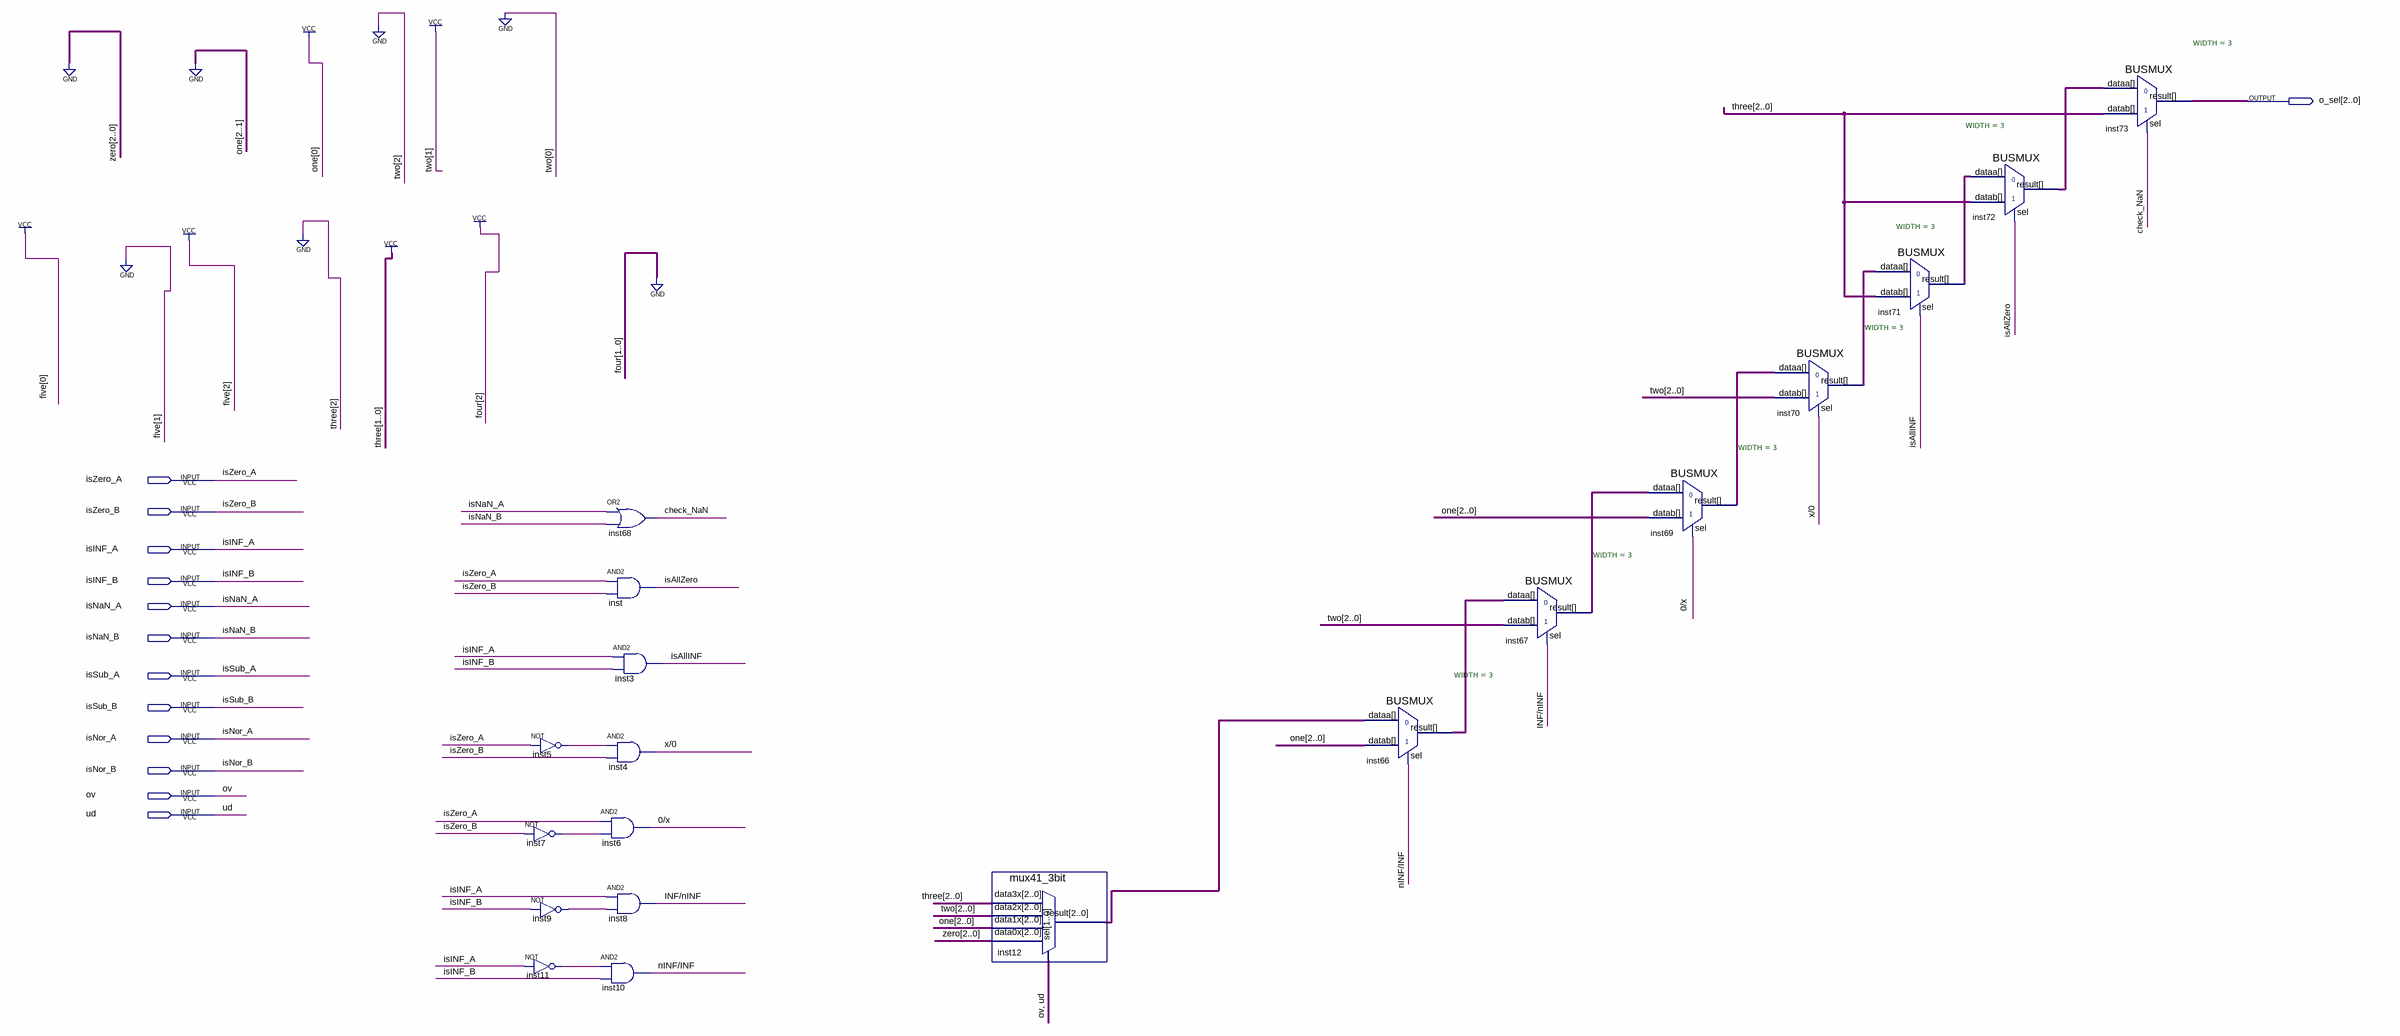
[diagram p0: schematic sheet]
// Quartus schematic divider_control_unit.bdf as structural Verilog: 19 symbols, 13 pins
module divider_control_unit (
  input  isZero_A,
  input  isZero_B,
  input  isINF_A,
  input  isINF_B,
  input  isNaN_A,
  input  isNaN_B,
  input  isSub_A,
  input  isSub_B,
  input  isNor_A,
  input  isNor_B,
  input  ov,
  input  ud,
  output [2:0] o_sel
);

  wire \0/x , check_NaN, \INF/nINF , inst5_out, inst7_out, inst9_out, inst11_out, isAllINF, isAllZero,
       \nINF/INF , \x/0 ;
  wire [2:0] inst12_result, inst66_result, inst67_result, inst69_result, inst70_result, inst71_result,
       inst72_result;

  not inst5 (inst5_out, isZero_A);
  not inst7 (inst7_out, isZero_B);
  not inst9 (inst9_out, isINF_B);
  not inst11 (inst11_out, isINF_A);
  or inst68 (check_NaN, isNaN_A, isNaN_B);
  and inst (isAllZero, isZero_A, isZero_B);
  and inst4 (\x/0 , inst5_out, isZero_B);
  and inst6 (\0/x , isZero_A, inst7_out);
  and inst8 (\INF/nINF , isINF_A, inst9_out);
  and inst10 (\nINF/INF , inst11_out, isINF_B);
  and inst3 (isAllINF, isINF_A, isINF_B);
  mux41_3bit inst12 (
    .data3x(3'b011), .data2x(3'b010), .data1x(3'b001), .data0x(3'b000), .sel({ov, ud}), .result(inst12_result));
  BUSMUX #(.WIDTH(3)) inst66 (.datab(3'b001), .sel(\nINF/INF ), .dataa(inst12_result), .result(inst66_result));
  BUSMUX #(.WIDTH(3)) inst67 (.datab(3'b010), .sel(\INF/nINF ), .dataa(inst66_result), .result(inst67_result));
  BUSMUX #(.WIDTH(3)) inst69 (.datab(3'b001), .sel(\0/x ), .dataa(inst67_result), .result(inst69_result));
  BUSMUX #(.WIDTH(3)) inst70 (.datab(3'b010), .sel(\x/0 ), .dataa(inst69_result), .result(inst70_result));
  BUSMUX #(.WIDTH(3)) inst71 (.datab(3'b011), .sel(isAllINF), .dataa(inst70_result), .result(inst71_result));
  BUSMUX #(.WIDTH(3)) inst72 (.datab(3'b011), .sel(isAllZero), .dataa(inst71_result), .result(inst72_result));
  BUSMUX #(.WIDTH(3)) inst73 (.datab(3'b011), .sel(check_NaN), .dataa(inst72_result), .result(o_sel));
endmodule
